# Altium schematic sheet room_automation_main.SchDoc
size A4
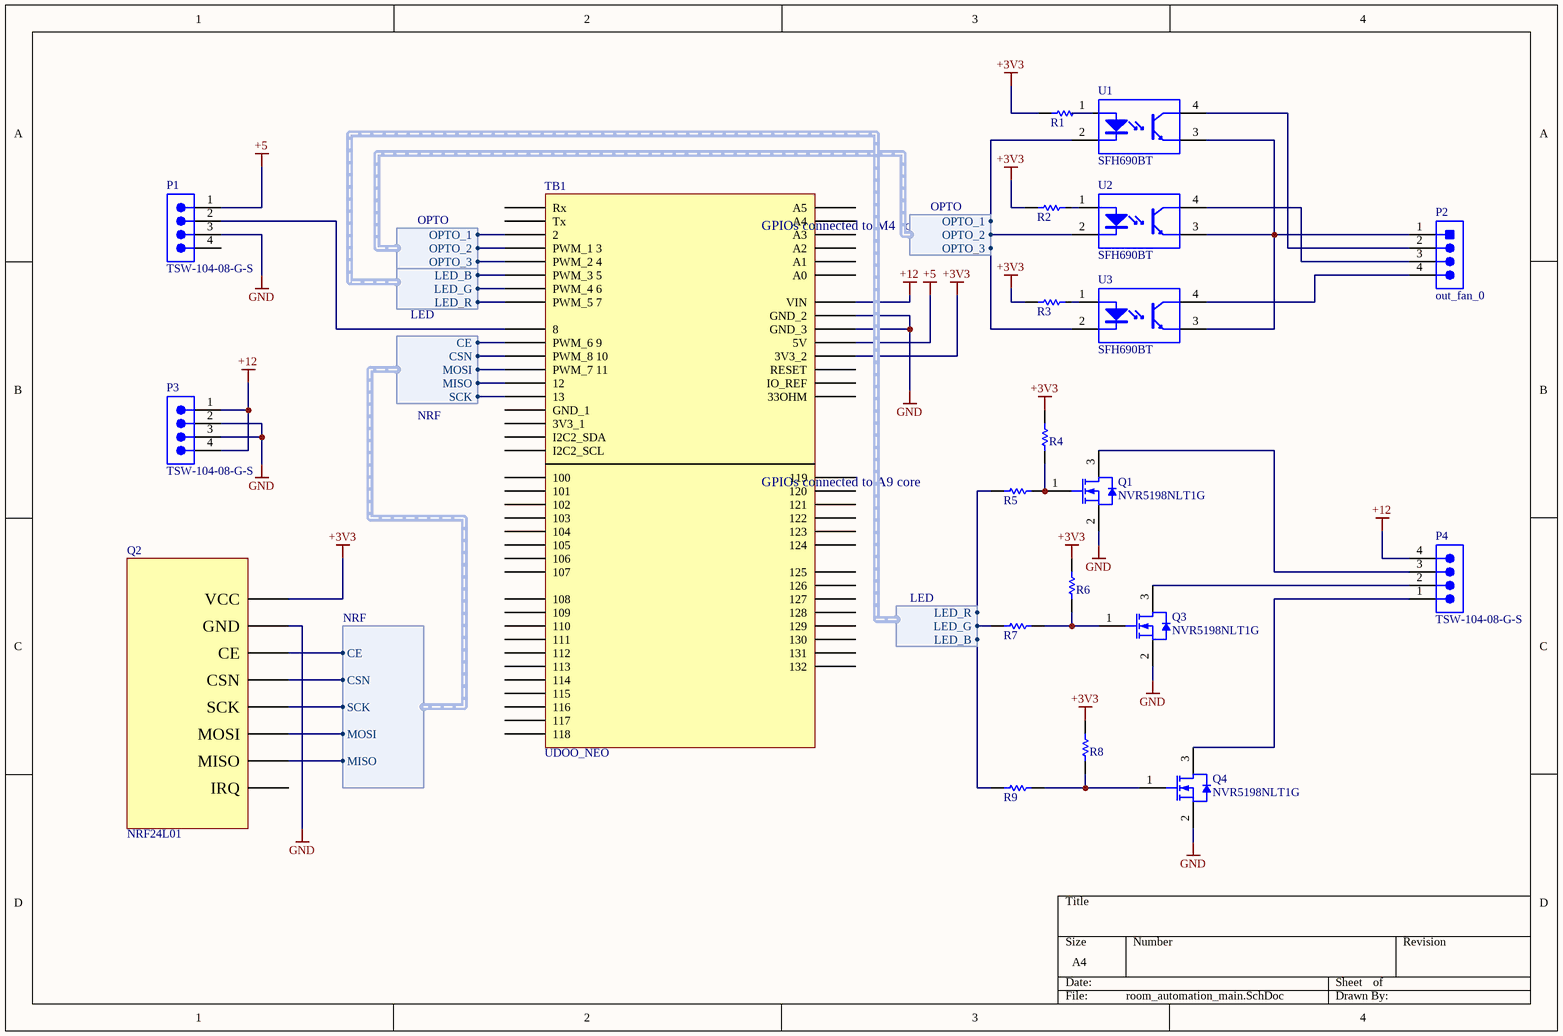
[diagram p0: room_automation_main.SchDoc]

## Parts
P1  TSW-104-08-G-S  [SMTC-TSW-104-08-X-S]
P2  out_fan_0  [TECO-640456-4]
P3  TSW-104-08-G-S  [SMTC-TSW-104-08-X-S]
P4  TSW-104-08-G-S  [SMTC-TSW-104-08-X-S]
Q1  NVR5198NLT1G  [ONSC-SOT-23-3-318-08_V]
Q2  NRF24L01  [NRF24L01]
Q3  NVR5198NLT1G  [ONSC-SOT-23-3-318-08_V]
Q4  NVR5198NLT1G  [ONSC-SOT-23-3-318-08_V]
R1  3R32 1% 1206(3216)  [RESC1206(3216)_N]  (value not drawn)
R2  3R32 1% 1206(3216)  [RESC1206(3216)_N]  (value not drawn)
R3  3R32 1% 1206(3216)  [RESC1206(3216)_N]  (value not drawn)
R4  3R32 1% 1206(3216)  [RESC1206(3216)_N]  (value not drawn)
R5  3R32 1% 1206(3216)  [RESC1206(3216)_N]  (value not drawn)
R6  3R32 1% 1206(3216)  [RESC1206(3216)_N]  (value not drawn)
R7  3R32 1% 1206(3216)  [RESC1206(3216)_N]  (value not drawn)
R8  3R32 1% 1206(3216)  [RESC1206(3216)_N]  (value not drawn)
R9  3R32 1% 1206(3216)  [RESC1206(3216)_N]  (value not drawn)
TB1  UDOO_NEO  [UDOO NEO]
U1  SFH690BT  [VISH-SOP-4_A_V]
U2  SFH690BT  [VISH-SOP-4_A_V]
U3  SFH690BT  [VISH-SOP-4_A_V]

## Harnesses
NRF: CE, CSN, SCK, MOSI, MISO
OPTO: OPTO_1, OPTO_2, OPTO_3
LED: LED_R, LED_G, LED_B

## Nets
+3V3: Q2.VCC R1.2 R2.2 R3.2 R4.1 R6.1 R8.1 TB1.3V3_2
+5: P1.1 TB1.5V
+12: P3.1 P3.4 P4.4 TB1.VIN
GND: P1.3 P3.2 P3.3 Q1.2(S) Q2.GND Q3.2(S) Q4.2(S) TB1.GND_2 TB1.GND_3
NetP1_2: P1.2 TB1.8
NetP2_1: P2.1 U1.3(EMITTER) U2.3(EMITTER) U3.3(EMITTER)
NetP2_2: P2.2 U1.4(COLLECTOR)
NetP2_3: P2.3 U2.4(COLLECTOR)
NetP2_4: P2.4 U3.4(COLLECTOR)
NetP4_1: P4.1 Q4.3(D)
NetP4_2: P4.2 Q3.3(D)
NetP4_3: P4.3 Q1.3(D)
NetQ1_1: Q1.1(G) R4.2 R5.1
NetQ2_CE: Q2.CE TB1.9(PWM_6_9) ; harness NRF.CE
NetQ2_CSN: Q2.CSN TB1.10(PWM_8_10) ; harness NRF.CSN
NetQ2_MISO: Q2.MISO TB1.12 ; harness NRF.MISO
NetQ2_MOSI: Q2.MOSI TB1.11(PWM_7_11) ; harness NRF.MOSI
NetQ2_SCK: Q2.SCK TB1.13 ; harness NRF.SCK
NetQ3_1: Q3.1(G) R6.2 R7.1
NetQ4_1: Q4.1(G) R8.2 R9.1
NetR1_1: R1.1 U1.1(ANODE)
NetR2_1: R2.1 U2.1(ANODE)
NetR3_1: R3.1 U3.1(ANODE)
NetR5_2: R5.2 TB1.7(PWM_5_7) ; harness LED.LED_R
NetR7_2: R7.2 TB1.6(PWM_4_6) ; harness LED.LED_G
NetR9_2: R9.2 TB1.5(PWM_3_5) ; harness LED.LED_B
NetTB1_2: TB1.2 U1.2(CATHODE) ; harness OPTO.OPTO_1
NetTB1_3: TB1.3(PWM_1_3) U2.2(CATHODE) ; harness OPTO.OPTO_2
NetTB1_4: TB1.4(PWM_2_4) U3.2(CATHODE) ; harness OPTO.OPTO_3

Not connected (* = marked no-connect by the designer): P1 4; Q2 IRQ; TB1 3V3_1 33OHM 100 101 102 103 104 105 106 107 108 109 110 111 112 113 114 115 116 117 118 119 120 121 122 123 124 125 126 127 128 129 130 131 132 A0 A1 A2 A3 A4 A5 GND_1 REF(IO_REF) RST(RESET) Rx SCL(I2C2_SCL) SDA(I2C2_SDA) Tx

## Notes on the sheet
- (in symbol UDOO_NEO) GPIOs connected to M4 core; GPIOs connected to A9 core

## Library data of the parts
P1 P3 P4 = CMP-1024-00357-1: 0.025" SQ Post Header, Through-hole, Vertical, -55 to 125 degC, 2.54 mm Pitch, 4-Pin, Male, RoHS; Manufacturer: Samtec; Pitch: 2.54 mm; RoHS: True; ComponentLink3URL: http://www.samtec.com/documents/webfiles/cpdf/TSW-XXX-XX-XXX-X-XX-XXX-MKT.pdf; Mounting Technology: Through-hole; ComponentLink2URL: http://www.samtec.com/documents/webfiles/pdf/TSW_TH.PDF; ComponentLink1URL: http://www.samtec.com; ComponentLink3Description: Package Specification; PackageVersion: DM, 8/1988; ComponentLink2Description: Datasheet; PackageReference: TSW-104-08-X-S; PackageDescription: .025[0.64] SQ. Post Terminal Strip Assembly; PartNumber: TSW-104-08-G-S; ComponentLink1Description: Manufacturer URL; Temperature Range: -55 to 125 degC; DatasheetVersion: F-214; Orientation: Vertical
P2 = CMP-2000-05419-1: Male Header, Pitch 2.54 mm, 1 x 4 Position, Height 10.03 mm, Tail Length 3.56 mm, RoHS, Bulk; Manufacturer: TE Connectivity; Material, Housing: Polyester; Primary Type: InterconnectSystem; Mount Angle: Vertical; Color, Housing: White; Current, Rating: 5 / A; Agency Approvals: CSA,UL; Contact Termination Area Plating: Tin; Temperature, Operating: -55to+105 / degC; Standards: RoHSCompliant,ELVCompliant,UL94V-0; Number of Positions: 4; Brand/Series: MTA-100Series; Angle: Straight; Pin Spacing: 0.1 / "; Material, Contact: CopperAlloy; Connector Type: MTA-100; Special Features: Pinstrip; Mounting Hole Size: 0.04 / "; Contact Centerline Spacing: 0.100 / in.; Voltage, Rating: 250 / V; Manufacturer URL: http://www.te.com/; Length, Pin: 0.14 / "; Length, Overall: 0.4 / "; Color: White; Flammability Rating: UL94V-0; Mounting Type: PCMount; Termination: Solder; Datasheet URL: https://datasheet.ciiva.com/16286/eng-ds-82056-mta-0608-16286228.pdf; Number of Contacts: 4; Contact Shape: Square; Contact Mating Area Plating: Tin; Length, Terminal Post: 0.14 / in.; Size, Post: 0.025 / in.; Contact Plating: Tin; Type: PCBPlug; Datasheet Version: Dec-14; Number of Rows: 1
Q1 Q3 Q4 = CMP-1058-00774-1: Power MOSFET, 60 V, 155 mOhm, Single N-Channel Logic Level, 3-Pin SOT-23, Pb-Free, Tape and Reel; Manufacturer: On Semiconductor; Ciss Typ (pF): 182; Coss Typ (pF): 25; ID Max (A): 2.2; Crss Typ (pF): 16; V(BR)DSS Min (V): 60; Qrr Typ (nC): 6; VGS Max (V): 20; VGS(th) Max (V): 2.5; Channel Polarity: N Channel; Package Type: SOT-23-3; ComponentLink1URL: http://www.onsemi.com/; ComponentLink2Description: Datasheet; ComponentLink1Description: Manufacturer URL; Mounting Technology: Surface Mount; Configuration: Single; Packing: Tape and Reel; RoHS: Pb-Free; ComponentLink3URL: http://www.onsemi.cn/pub_link/Collateral/318-08.PDF; PackageVersion: Rev. AP, 11/2009; PackageReference: SOT-23-3-318-08; DatasheetVersion: Rev. 1; PackageDescription: 3-Pin Small Outline Transistor, Body 2.92 x 1.3 mm, Pitch 0.95 mm; ComponentLink3Description: Package Specification; ComponentLink2URL: http://www.onsemi.com/pub_link/Collateral/NVR5198NL-D.PDF; PartNumber: NVR5198NLT1G
R1-R9 = CMP-1014-00229-1: 3R32 0.25W 1% 1206 (3216 Metric)  SMD; Case-Metric: 3216; Value: 3.32 Ohm; Case-EIA: 1206; Power: 0.25 W; Technology: SMT; Tolerance: 1 %
U1-U3 = CMP-2000-07046-1: Optocoupler Phototransistor Output, 6 V, 50 mA, -55 to 100 degC, 4-Pin SOIC, RoHS, Tape and Reel; Manufacturer: Vishay; Collector Current (DC): 0.1A; Input Type: DC; Collector-Emitter Voltage: 70V; Forward Current: 50mA; Isolation Voltage: 3750V; DELETED: Compliant; Collector-Emitter Saturation Voltage: 0.3V; Power Dissipation: 0.15W; Reverse Breakdown Voltage: 6V; Number of  Elements: 1; Forward Voltage: 1.4V; Rad Hardened: No; Current Transfer Ratio: 300%; Datasheet Version: Rev. 2.6, 11/2015; Manufacturer URL: http://www.vishay.com/; Output Type: DC; Package Reference: SOP-4; Operating Temperature Classification: Industrial; Mounting Technology: SurfaceMount; Mounting: SurfaceMount; Output Device: Transistor; Package Description: 4-Pin Small Outline Package Integrated Circuit, Body 4.575 x 4.42 mm, Pitch 2.54 mm; Package Type: SOP; Operating Temp Range: -55Cto100C; Packaging: TapeandReel; Collector Current (DC) (Max): 0.1A; Pin Count: 4; Datasheet URL: http://www.vishay.com/docs/83686/sfh690ab.pdf